# Altium schematic sheet MPPT_POWER_STAGE.SchDoc
size A3; SheetNumber: 2; SheetTotal: 2
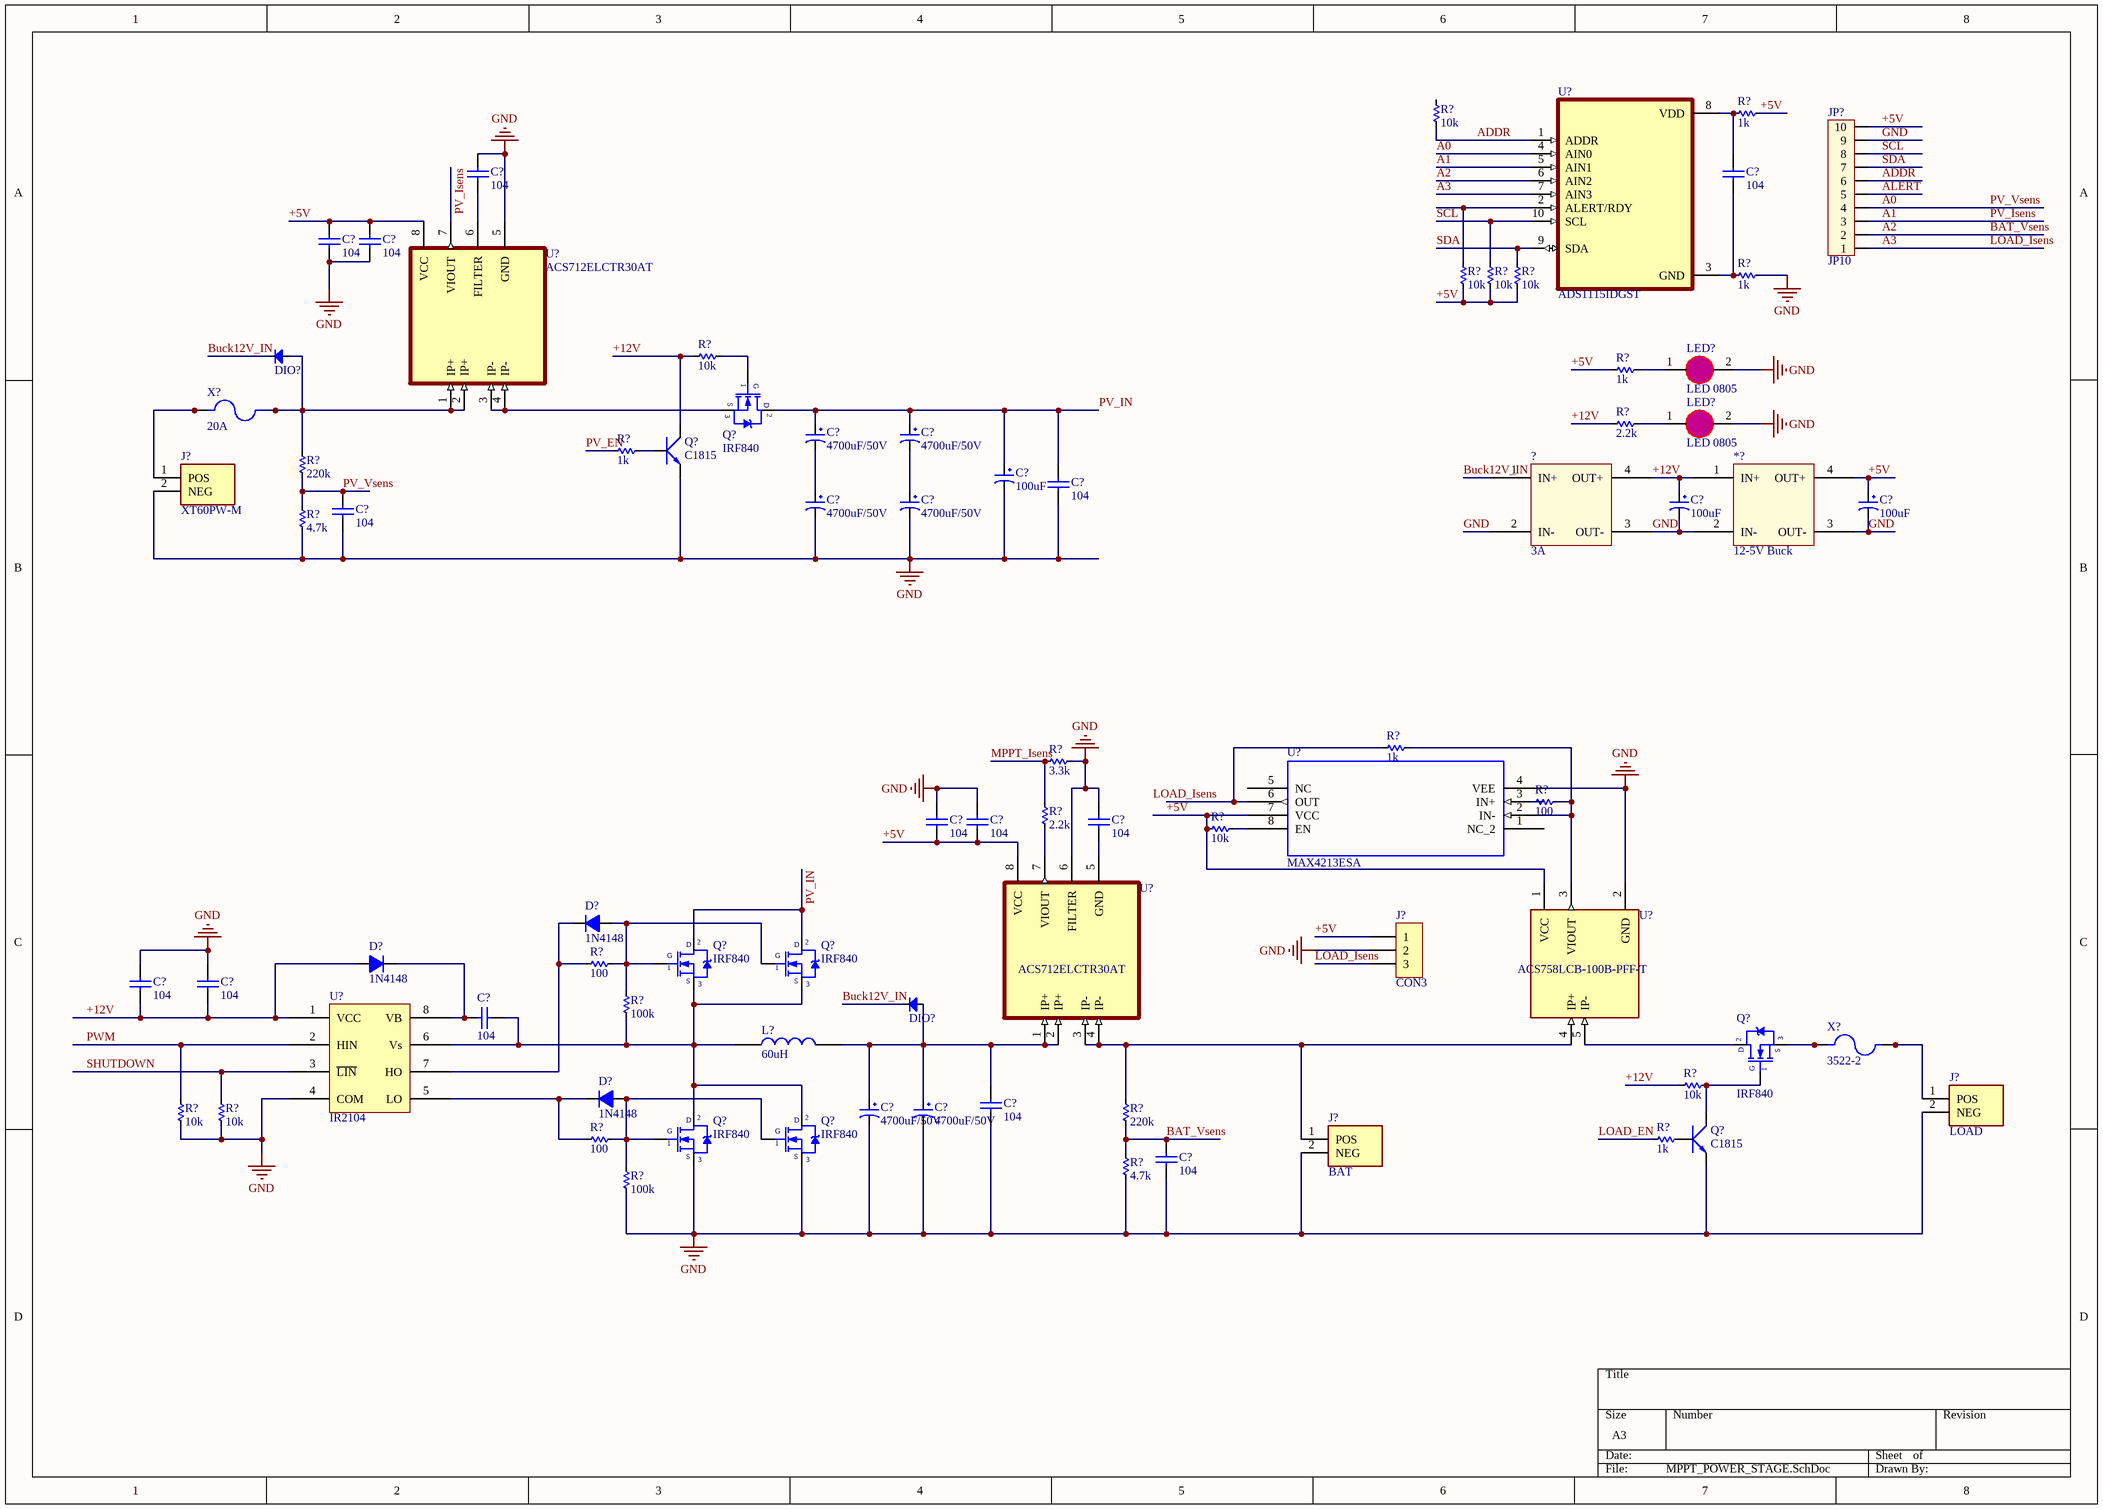
[diagram p0: MPPT_POWER_STAGE.SchDoc]

## Parts
(Parts that share a designator on the sheet are numbered #1, #2 ... from top to bottom, then left to right.)
*?  12-5V Buck  [12-5V BUCK]
?  3A  [90-12V BUCK]
C?#1  104  [0805]
C?#2  104  [0805]
C?#3  104  [0805]
C?#4  104  [0805]
C?#5  4700uF/50V  [CP4/8.5]
C?#6  4700uF/50V  [CP4/8.5]
C?#7  100uF  [CP1/2.5]
C?#8  104  [0805]
C?#9  4700uF/50V  [CP4/8.5]
C?#10  4700uF/50V  [CP4/8.5]
C?#11  100uF  [CP1/2.5]
C?#12  100uF  [CP1/2.5]
C?#13  104  [0805]
C?#14  104  [0805]
C?#15  104  [0805]
C?#16  104  [0805]
C?#17  104  [0805]
C?#18  104  [0805]
C?#19  104  [0805]
C?#20  4700uF/50V  [CP4/8.5]
C?#21  4700uF/50V  [CP4/8.5]
C?#22  104  [0805]
C?#23  104  [0805]
D?#1  1N4148  [D0.5A]
D?#2  1N4148  [D0.5A]
D?#3  1N4148  [D0.5A]
DIO?#1  Diode SMD  [DIO-SMD-106]  (value not drawn)
DIO?#2  Diode SMD  [DIO-SMD-106]  (value not drawn)
J?#1  XT60PW-M  [AMASS_XT60PW-M]
J?#2  CON3  [CON3]
J?#3  LOAD  [AMASS_XT60PW-M]
J?#4  BAT  [AMASS_XT60PW-M]
JP?  JP10  [CON10]
L?  60uH  [100UH]
LED?#1  LED 0805  [LED0805]
LED?#2  LED 0805  [LED0805]
Q?#1  IRF840  [QTO-220]
Q?#2  C1815  [SOT23B]
Q?#3  IRF840  [QTO-220]
Q?#4  IRF840  [QTO-220]
Q?#5  IRF840  [QTO-220]
Q?#6  IRF840  [QTO-220]
Q?#7  IRF840  [QTO-220]
Q?#8  C1815  [SOT23B]
R?#1  10k  [RES-SMD-0805]
R?#2  1k  [RES-SMD-0805]
R?#3  10k  [RES-SMD-0805]
R?#4  10k  [RES-SMD-0805]
R?#5  10k  [RES-SMD-0805]
R?#6  1k  [RES-SMD-0805]
R?#7  10k  [RES-SMD-0805]
R?#8  1k  [RES-SMD-0805]
R?#9  2.2k  [RES-SMD-0805]
R?#10  1k  [RES-SMD-0805]
R?#11  220k  [RES-SMD-0805]
R?#12  4.7k  [RES-SMD-0805]
R?#13  1k  [RES-SMD-0805]
R?#14  3.3k  [RES-SMD-0805]
R?#15  100  [RES-SMD-0805]
R?#16  2.2k  [RES-SMD-0805]
R?#17  10k  [RES-SMD-0805]
R?#18  100  [RES-SMD-0805]
R?#19  100k  [RES-SMD-0805]
R?#20  10k  [RES-SMD-0805]
R?#21  10k  [RES-SMD-0805]
R?#22  10k  [RES-SMD-0805]
R?#23  220k  [RES-SMD-0805]
R?#24  100  [RES-SMD-0805]
R?#25  1k  [RES-SMD-0805]
R?#26  4.7k  [RES-SMD-0805]
R?#27  100k  [RES-SMD-0805]
U?#1  ADS1115IDGST  [SOP50P490X110-10N]
U?#2  ACS712ELCTR30AT  [SOIC127P600X175-8N]
U?#3  MAX4213ESA  [21-0041B_8]
U?#4  ACS712ELCTR30AT  [SOIC127P600X175-8N]
U?#5  ACS758LCB-100B-PFF-T  [XDCR_ACS770KCB-150U-PFF-T]
U?#6  IR2104  [dip8]
X?#1  20A  [FUSE_3522-2]
X?#2  3522-2  [FUSE_3522-2]

## Nets
GND: *?.2(IN-) *?.3(OUT-) ?.2(IN-) ?.3(OUT-) C?#1.2 C?#3.2 C?#4.2 C?#7.2 C?#8.1 C?#9.2 C?#10.2 C?#11.2 C?#12.2 C?#13.1 C?#14.1 C?#15.1 C?#16.1 C?#17.2 C?#18.2 C?#20.2 C?#21.2 C?#22.1 C?#23.1 J?#1.2(NEG) J?#2.2 J?#3.2(NEG) J?#4.2(NEG) JP?.9 LED?#1.2(K) LED?#2.2(K) Q?#2.3(E) Q?#6.3(S) Q?#7.3(S) Q?#8.3(E) R?#6.1 R?#12.2 R?#14.2 R?#21.1 R?#22.1 R?#26.2 R?#27.2 U?#2.5(GND) U?#3.4(VEE) U?#4.6(FILTER) U?#5.2(GND) U?#6.4(COM)
+5V: *?.4(OUT+) C?#3.1 C?#4.1 C?#12.1 C?#14.2 C?#15.2 J?#2.1 JP?.10 R?#2.1 R?#3.2 R?#4.1 R?#5.2 R?#8.1 R?#17.1 U?#2.8(VCC) U?#3.7(VCC) U?#4.8(VCC) U?#5.1(VCC)
+12V: *?.1(IN+) ?.4(OUT+) C?#11.1 C?#17.1 C?#18.1 D?#2.1(A) Q?#2.2(C) R?#7.1 R?#9.1 R?#20.1 U?#6.1(VCC)
A0: C?#13.2 JP?.4 R?#11.2 R?#12.1 U?#1.4(AIN0)  [also labelled PV_Vsens]
A1: JP?.3 U?#1.5(AIN1) U?#2.7(VIOUT)  [also labelled PV_Isens]
A2: C?#23.2 JP?.2 R?#23.2 R?#26.1 U?#1.6(AIN2)  [also labelled BAT_Vsens]
A3: J?#2.3 JP?.1 U?#1.7(AIN3)  [also labelled LOAD_Isens]
ADDR: JP?.6 R?#1.1 U?#1.1(ADDR)
ALERT: JP?.5
Buck12V_IN: ?.1(IN+) DIO?#1.2(K) DIO?#2.2(K)
LOAD_EN: R?#25.2
MPPT_Isens: R?#14.1 R?#16.2
PV_EN: R?#10.2
PV_IN: C?#5.1 C?#6.1 C?#7.1 C?#8.2 Q?#1.2(D) Q?#3.2(D) Q?#4.2(D)
PWM: R?#21.2 U?#6.2(HIN)
SCL: JP?.8 R?#4.2 U?#1.10(SCL)
SDA: JP?.7 R?#5.1 U?#1.9(SDA)
SHUTDOWN: R?#22.2 U?#6.3(~{LIN})
NetC?#1_1: C?#1.1 U?#2.6(FILTER)
NetC?#2_1: C?#2.1 R?#6.2 U?#1.3(GND)
NetC?#2_2: C?#2.2 R?#2.2 U?#1.8(VDD)
NetC?#5_2: C?#5.2 C?#9.1
NetC?#6_2: C?#6.2 C?#10.1
NetC?#16_2: C?#16.2 U?#4.5(GND)
NetC?#19_1: C?#19.1 L?.1 Q?#3.3(S) Q?#4.3(S) Q?#6.2(D) Q?#7.2(D) R?#19.2 U?#6.6(Vs)
NetC?#19_2: C?#19.2 D?#2.2(K) U?#6.8(VB)
NetC?#20_1: C?#20.1 C?#21.1 C?#22.2 DIO?#2.1(A) L?.2 U?#4.1(IP+) U?#4.2(IP+)
NetD?#1_1: D?#1.1(A) Q?#3.1(G) Q?#4.1(G) R?#18.1 R?#19.1
NetD?#1_2: D?#1.2(K) R?#18.2 U?#6.7(HO)
NetD?#3_1: D?#3.1(A) Q?#6.1(G) Q?#7.1(G) R?#24.2 R?#27.1
NetD?#3_2: D?#3.2(K) R?#24.1 U?#6.5(LO)
NetDIO?#1_1: DIO?#1.1(A) R?#11.1 U?#2.1(IP+) U?#2.2(IP+) X?#1.2A X?#1.2B
NetJ?#1_1: J?#1.1(POS) X?#1.1A X?#1.1B
NetJ?#3_1: J?#3.1(POS) X?#2.2A X?#2.2B
NetJ?#4_1: J?#4.1(POS) R?#23.1 U?#4.3(IP-) U?#4.4(IP-) U?#5.4(IP+)
NetLED?#1_1: LED?#1.1(A) R?#8.2
NetLED?#2_1: LED?#2.1(A) R?#9.2
NetQ?#1_1: Q?#1.1(G) R?#7.2
NetQ?#1_3: Q?#1.3(S) U?#2.3(IP-) U?#2.4(IP-)
NetQ?#2_1: Q?#2.1(B) R?#10.1
NetQ?#5_1: Q?#5.1(G) Q?#8.2(C) R?#20.2
NetQ?#5_2: Q?#5.2(D) U?#5.5(IP-)
NetQ?#5_3: Q?#5.3(S) X?#2.1A X?#2.1B
NetQ?#8_1: Q?#8.1(B) R?#25.1
NetR?#3_1: R?#3.1 U?#1.2(ALERT/RDY)
NetR?#13_1: R?#13.1 U?#3.6(OUT)
NetR?#13_2: R?#13.2 R?#15.2 U?#3.2(IN-) U?#5.3(VIOUT)
NetR?#15_1: R?#15.1 U?#3.3(IN+)
NetR?#16_1: R?#16.1 U?#4.7(VIOUT)
NetR?#17_2: R?#17.2 U?#3.8(EN)

Not connected (* = marked no-connect by the designer): R?#1 2; U?#3 1(NC_2) 5(NC)

## Notes on the sheet
- Labels drawn without touching a wire or pin: LOAD_Isens

## Library data of the parts
*? = 12-5V Buck: 3A
? = 90-12V  Buck
C?#1-C?#4 C?#8 C?#13-C?#19 C?#22 C?#23 = Cap 104: Capacitor (Semiconductor SIM Model); Value: 0.1uF; Published: 8-Jun-2000; LatestRevisionDate: 17-Jul-2002; LatestRevisionNote: Re-released for DXP Platform.; PackageReference: C1206; Publisher: Altium Limited
C?#5 C?#6 C?#9 C?#10 C?#20 C?#21 = CP7: Cap 4700uF/50V; Value: 4700uF/50V
C?#7 C?#11 C?#12 = CP2: C 47uF/50V , 220uF/16V; Value: 47uF/16 - 50V; Description 1: 470uF/6,3V - 330uF/10V - 220uF/16V; Description 2: 100uF/25V - 35V - 47uF/50V - 22uF/100V; Description 3: 33uF => 47uF/63V - 1uF => 4,7uF/160V; Description 4: 1uF => 2,2uF/250V - 1uF/350V
D?#1-D?#3 = D0.5A: Value: 1N4148
DIO?#1 DIO?#2 = Diode SMD: Default Diode; Code - JEDEC: DO-214-AB; Value: 1N5007; Published: 8-Jun-2000; Revision: July-2002: Re-released for DXP Platform.; Publisher: Altium Limited
J?#1 J?#3 J?#4 = XT60PW-M: Socket, DC supply, male, PIN: 2; MF: AMASS; Check_prices: https://www.snapeda.com/parts/XT60PW-M/AMASS/view-part/?ref=eda; SnapEDA_Link: https://www.snapeda.com/parts/XT60PW-M/AMASS/view-part/?ref=snap; Price: None; Availability: Not in stock; Package: Package; MP: XT60PW-M; Value: *
J?#2 = CON3: Connector
JP? = Con10: Connector 10; Value: Connector 10
L? = INDUCTOR
LED?#1 LED?#2 = LEDSMD: Dán; Don_Vi: Con; Ten_Linh_Kien: *; Ma_Hang: *; Ghi_Chu: *; Kieu_Chan: *; Chung_Loai: Dán
Q?#1 Q?#3-Q?#7 = IRF840: MOSFET N - CHANNEL 500V - 0.75 - 8A - TO-220; Value: IRF840
Q?#2 Q?#8 = C1815: Dán; Ten_Linh_Kien: C1815 SOT23 TRANS NPN 0.15A 50V (SMD-HF); Don_Vi: Con; Ma_Hang: MH000946; Ghi_Chu: *; Kieu_Chan: *; Chung_Loai: Dán
R?#1-R?#27 = Res-SMD: Resistor; Manufacturer: Generic Components; Class: Passive; Published: 08/06/2000; Publisher: Altium Hobart Technology Centre
U?#2 U?#4 = ACS712ELCTR30AT: Current Sensor 30A 1 Channel Hall Effect, Open Loop Bidirectional 8-SOIC (0.154, 3.90mm Width); MP: ACS712ELCTR-30A-T; MF: Allegro; Price: None; Availability: In Stock; Package: SOIC-8 Allegro MicroSystems LLC; SnapEDA_Link: https://www.snapeda.com/parts/ACS712ELCTR-30A-T/Allegro+Industries/view-part/?ref=snap; Check_prices: https://www.snapeda.com/parts/ACS712ELCTR-30A-T/Allegro+Industries/view-part/?ref=eda; Value: *; Purchase-URL: https://pricing.snapeda.com/search/part/ACS712ELCTR-30A-T/?ref=eda
U?#5 = ACS758LCB-100B-PFF-T: Current Sensor 100A 1 Channel Hall Effect, Open Loop Bidirectional 5-CB Formed Leads, PFF; MF: Allegro; Price: None; Availability: In Stock; Package: 5-CB-5 Allegro MicroSystems LLC; MP: ACS758LCB-100B-PFF-T; Value: *; SnapEDA_Link: https://www.snapeda.com/parts/ACS758LCB-100B-PFF-T/Allegro+Industries/view-part/?ref=snap; Purchase-URL: https://pricing.snapeda.com/search/part/ACS758LCB-100B-PFF-T/?ref=eda; Check_prices: https://www.snapeda.com/parts/ACS758LCB-100B-PFF-T/Allegro+Industries/view-part/?ref=eda
U?#6 = IR2103
X?#1 X?#2 = 3522-2: MF: {'manufacturer': u'Keystone Electronics'}; Availability: Unavailable; Price: None; Value: *; MP: 3522-2; Package: None
U?#1 = ADS1115IDGST: MP: ADS1115IDGST; Value: *; Price: None; Package: None; Availability: Unavailable
U?#3 = MAX4213ESA: Package: None; Price: None; Value: *; MP: MAX4213ESA; Availability: Unavailable